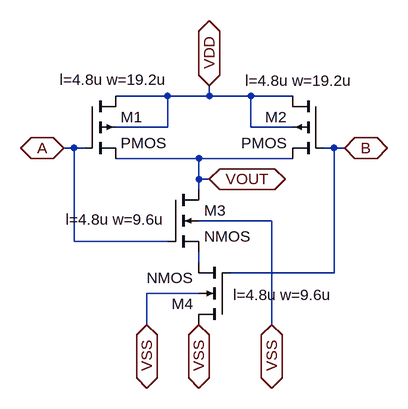
[diagram p0: schematic nand.asc]
nand.asc, the LTspice schematic file:
Version 4
SHEET 1 880 680
WIRE 208 32 128 32
WIRE 272 32 272 16
WIRE 272 32 208 32
WIRE 336 32 272 32
WIRE 400 32 336 32
WIRE 208 80 208 32
WIRE 208 80 128 80
WIRE 336 80 336 32
WIRE 400 80 336 80
WIRE 64 112 48 112
WIRE 80 112 64 112
WIRE 464 112 448 112
WIRE 480 112 464 112
WIRE 256 128 128 128
WIRE 400 128 256 128
WIRE 256 160 256 128
WIRE 272 160 256 160
WIRE 256 176 256 160
WIRE 368 224 256 224
WIRE 64 256 64 112
WIRE 208 256 64 256
WIRE 256 288 256 272
WIRE 464 304 464 112
WIRE 464 304 304 304
WIRE 256 336 176 336
WIRE 176 384 176 336
WIRE 368 384 368 224
FLAG 256 384 VSS
IOPIN 256 384 BiDir
FLAG 48 112 A
IOPIN 48 112 BiDir
FLAG 480 112 B
IOPIN 480 112 BiDir
FLAG 176 384 VSS
IOPIN 176 384 BiDir
FLAG 272 16 VDD
IOPIN 272 16 BiDir
FLAG 368 384 VSS
IOPIN 368 384 BiDir
FLAG 272 160 VOUT
IOPIN 272 160 BiDir
SYMBOL pmos4 80 32 R0
WINDOW 123 -38 -25 Left 2
SYMATTR Value2 l=4.8u w=19.2u
SYMATTR InstName M1
SYMBOL pmos4 448 32 M0
WINDOW 123 -45 -24 Left 2
SYMATTR Value2 l=4.8u w=19.2u
SYMATTR InstName M2
SYMBOL nmos4 208 176 R0
WINDOW 123 -157 46 Left 2
SYMATTR Value2 l=4.8u w=9.6u
SYMATTR InstName M3
SYMBOL nmos4 304 384 R180
WINDOW 123 -157 46 Left 2
SYMATTR Value2 l=4.8u w=9.6u
SYMATTR InstName M4

The netlist it stands for:
* nand.asc
M1 VDD A VOUT VDD PMOS l=4.8u w=19.2u
M2 VDD B VOUT VDD PMOS l=4.8u w=19.2u
M3 VOUT A N001 VSS NMOS l=4.8u w=9.6u
M4 VSS B N001 VSS NMOS l=4.8u w=9.6u
.model NMOS NMOS
.model PMOS PMOS
.lib standard.mos
.backanno
.end